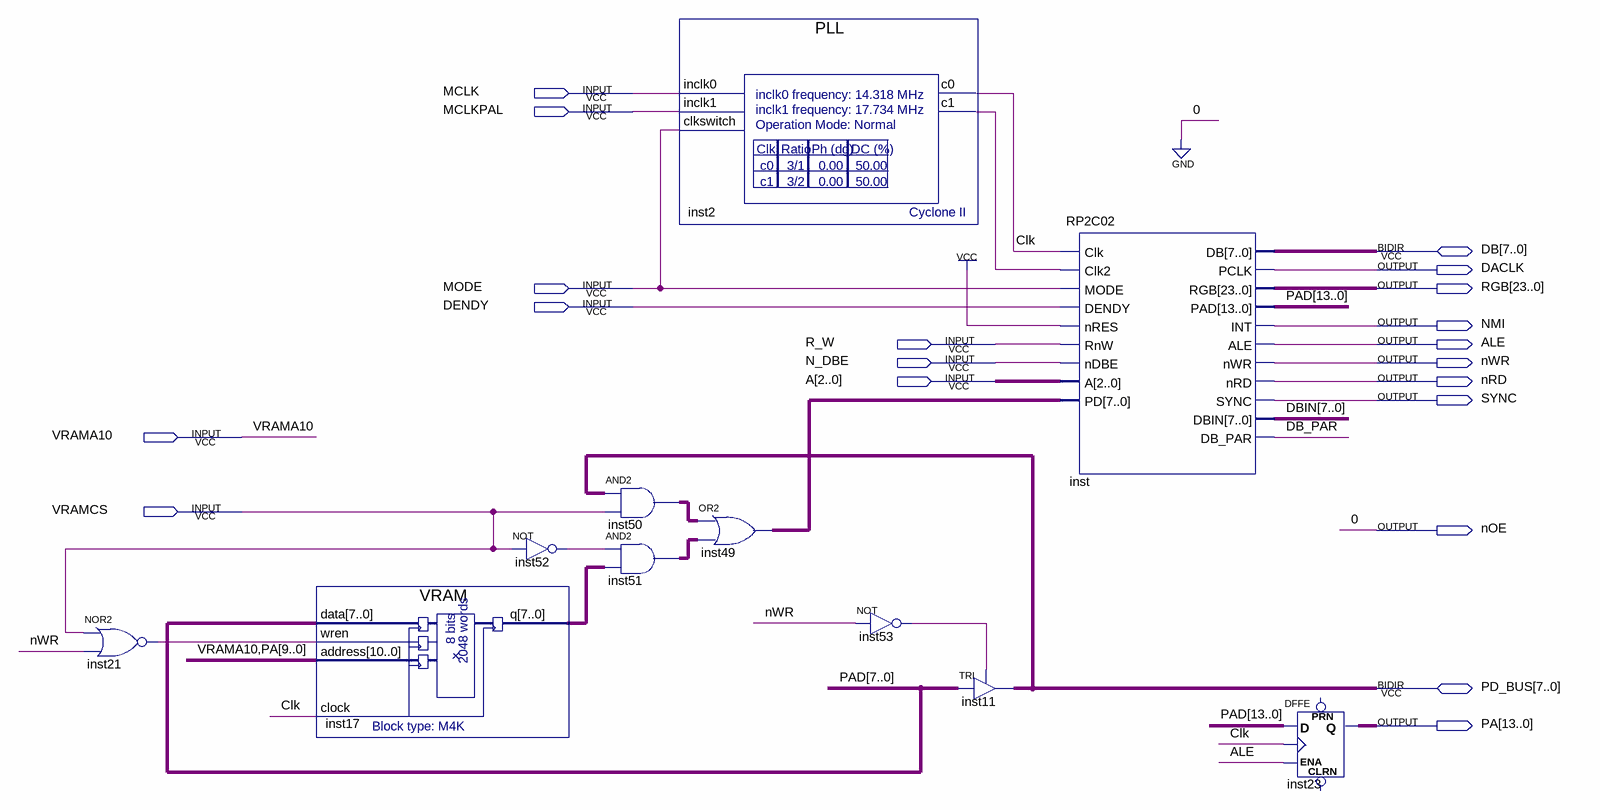
[diagram p0: schematic sheet]
// Quartus schematic V3.bdf as structural Verilog: 11 symbols, 20 pins
module V3 (
  input  MCLK,
  input  MCLKPAL,
  input  MODE,
  input  DENDY,
  input  R_W,
  input  N_DBE,
  input  [2:0] A,
  input  VRAMA10,
  input  VRAMCS,
  inout  [7:0] DB,
  inout  [7:0] PD_BUS,
  output DACLK,
  output [23:0] RGB,
  output NMI,
  output ALE,
  output nWR,
  output nRD,
  output SYNC,
  output nOE,
  output [13:0] PA
);

  wire Clk, DB_PAR, inst2_c1, inst21_out, inst52_out, inst53_out;
  wire [7:0] DBIN, inst17_q, inst49_out, inst50_out, inst51_out;
  wire [13:0] PAD;

  nor inst21 (inst21_out, VRAMCS, nWR);
  VRAM inst17 (.data(PAD[7:0]), .wren(inst21_out), .address({VRAMA10, PA[9:0]}), .clock(Clk), .q(inst17_q));
  not inst52 (inst52_out, VRAMCS);
  assign inst50_out = PD_BUS & {8{VRAMCS}};  // AND2 inst50, 8 bits wide
  assign inst51_out = {8{inst52_out}} & inst17_q;  // AND2 inst51, 8 bits wide
  PLL inst2 (.inclk0(MCLK), .inclk1(MCLKPAL), .clkswitch(MODE), .c0(Clk), .c1(inst2_c1));
  assign inst49_out = inst50_out | inst51_out;  // OR2 inst49, 8 bits wide
  not inst53 (inst53_out, nWR);
  TRI inst11[7:0] (.IN(PAD[7:0]), .OE(inst53_out), .OUT(PD_BUS));
  RP2C02 inst (
    .Clk(Clk), .Clk2(inst2_c1), .MODE(MODE), .DENDY(DENDY), .nRES(1'b1), .RnW(R_W), .nDBE(N_DBE), .A(A),
    .PD(inst49_out), .PCLK(DACLK), .RGB(RGB), .PAD(PAD), .INT(NMI), .ALE(ALE), .nWR(nWR), .nRD(nRD),
    .SYNC(SYNC), .DBIN(DBIN), .DB_PAR(DB_PAR), .DB(DB));
  DFFE inst23[13:0] (.D(PAD), .CLK(Clk), .ENA(ALE), .Q(PA));  // open: PRN, CLRN

  assign nOE = 1'b0;
endmodule
